# EAGLE schematic ButtonsLEDs (EAGLE 7.4.0)
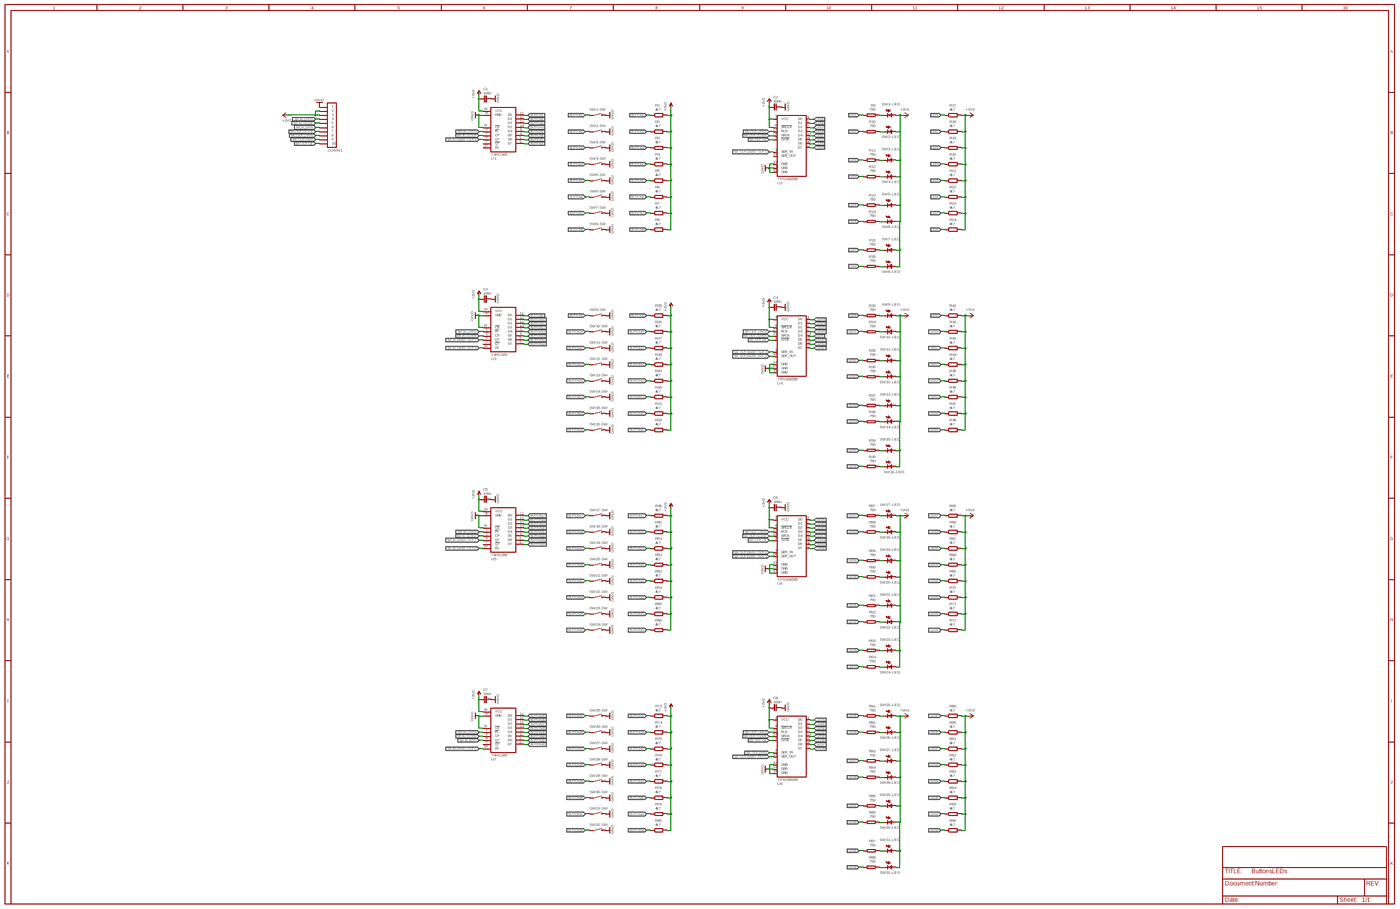
[diagram p0: schematic, sheet 1, overview]
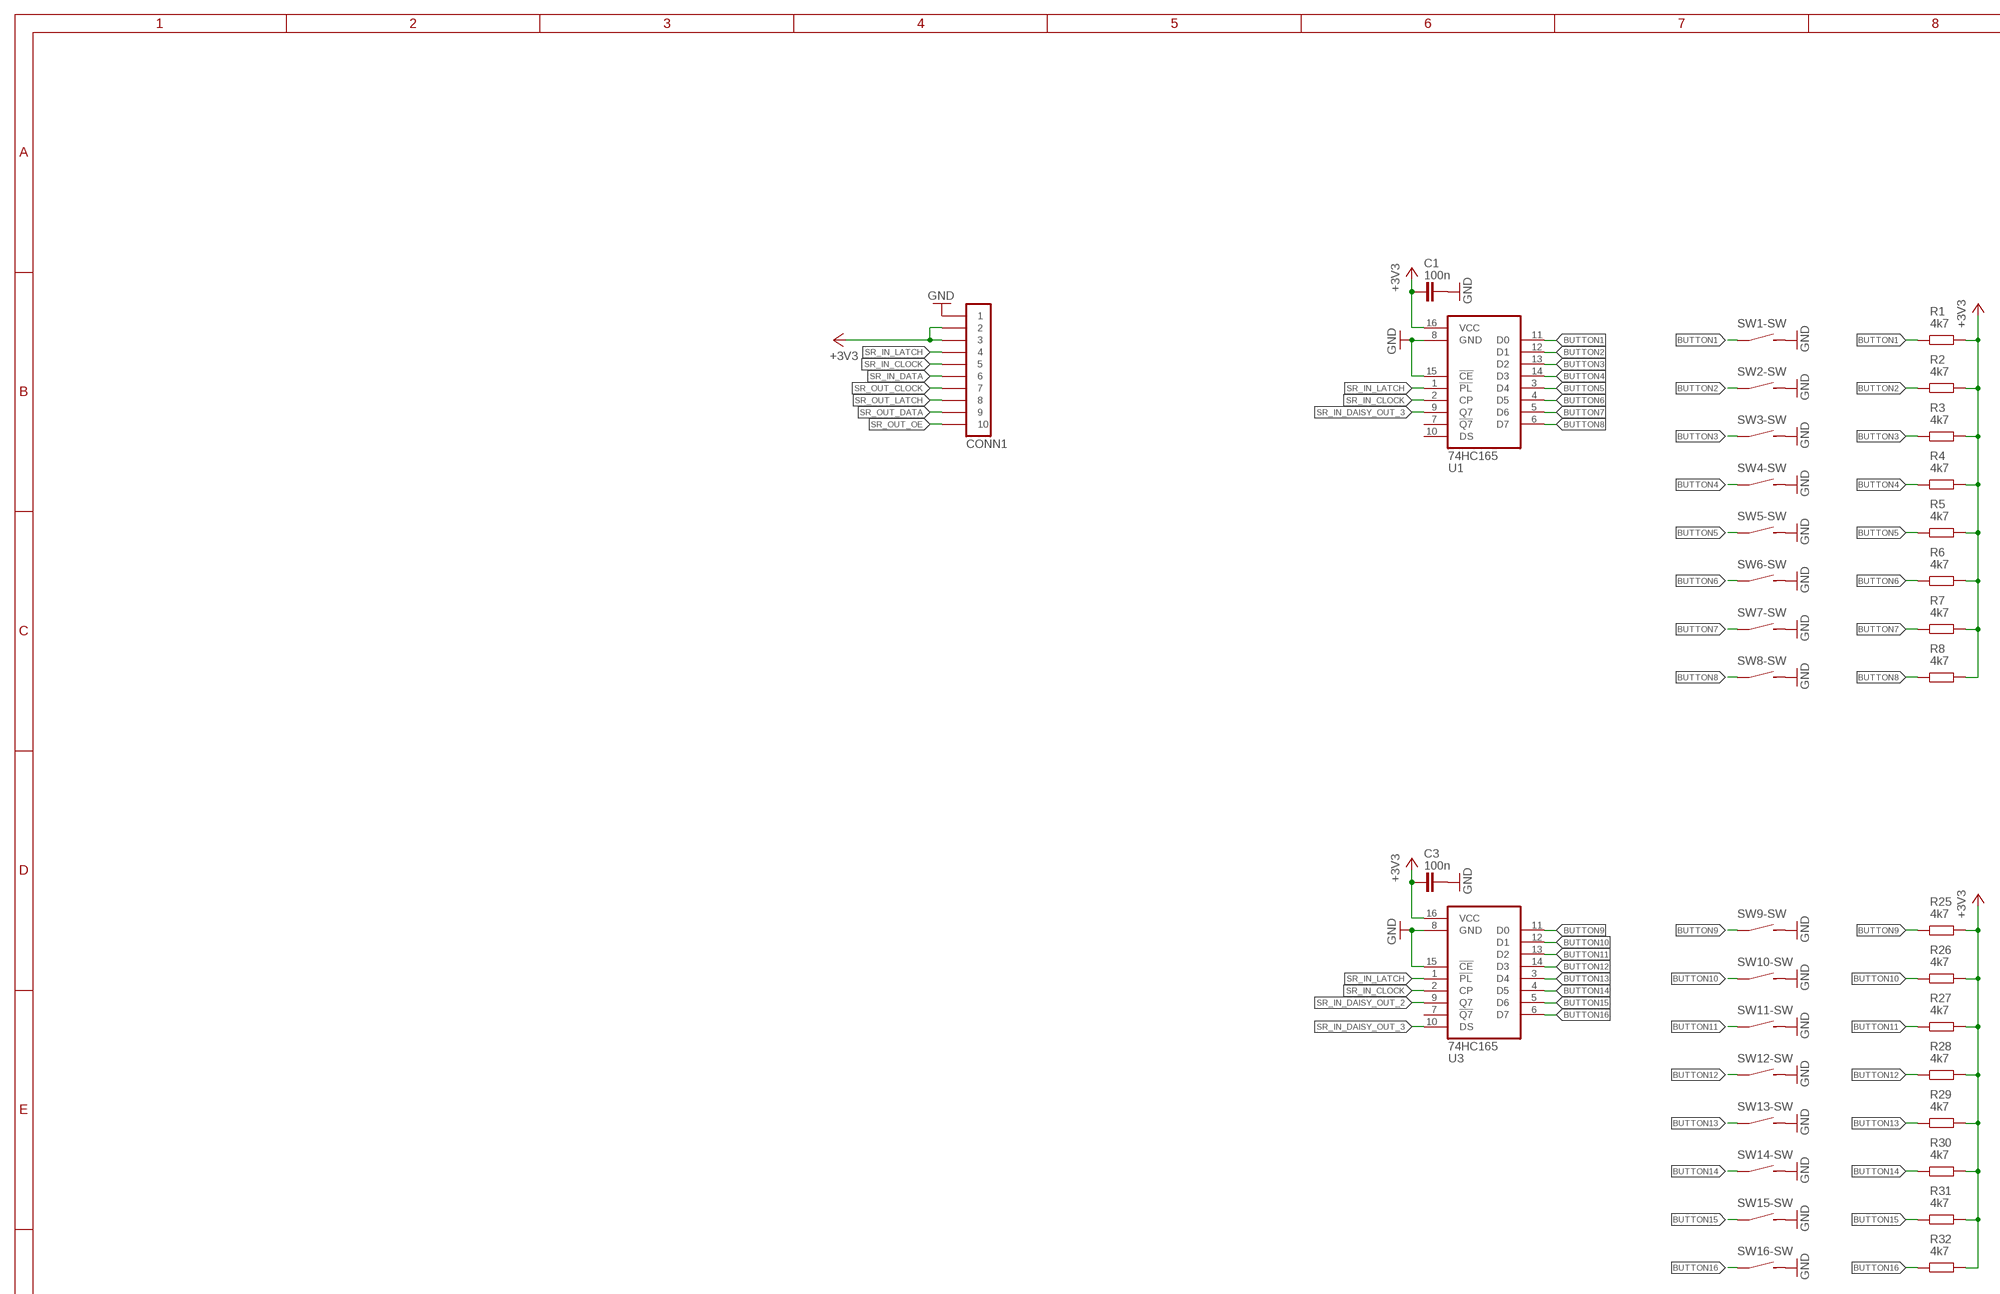
[diagram p1: schematic, sheet 1, part 1 of 4]
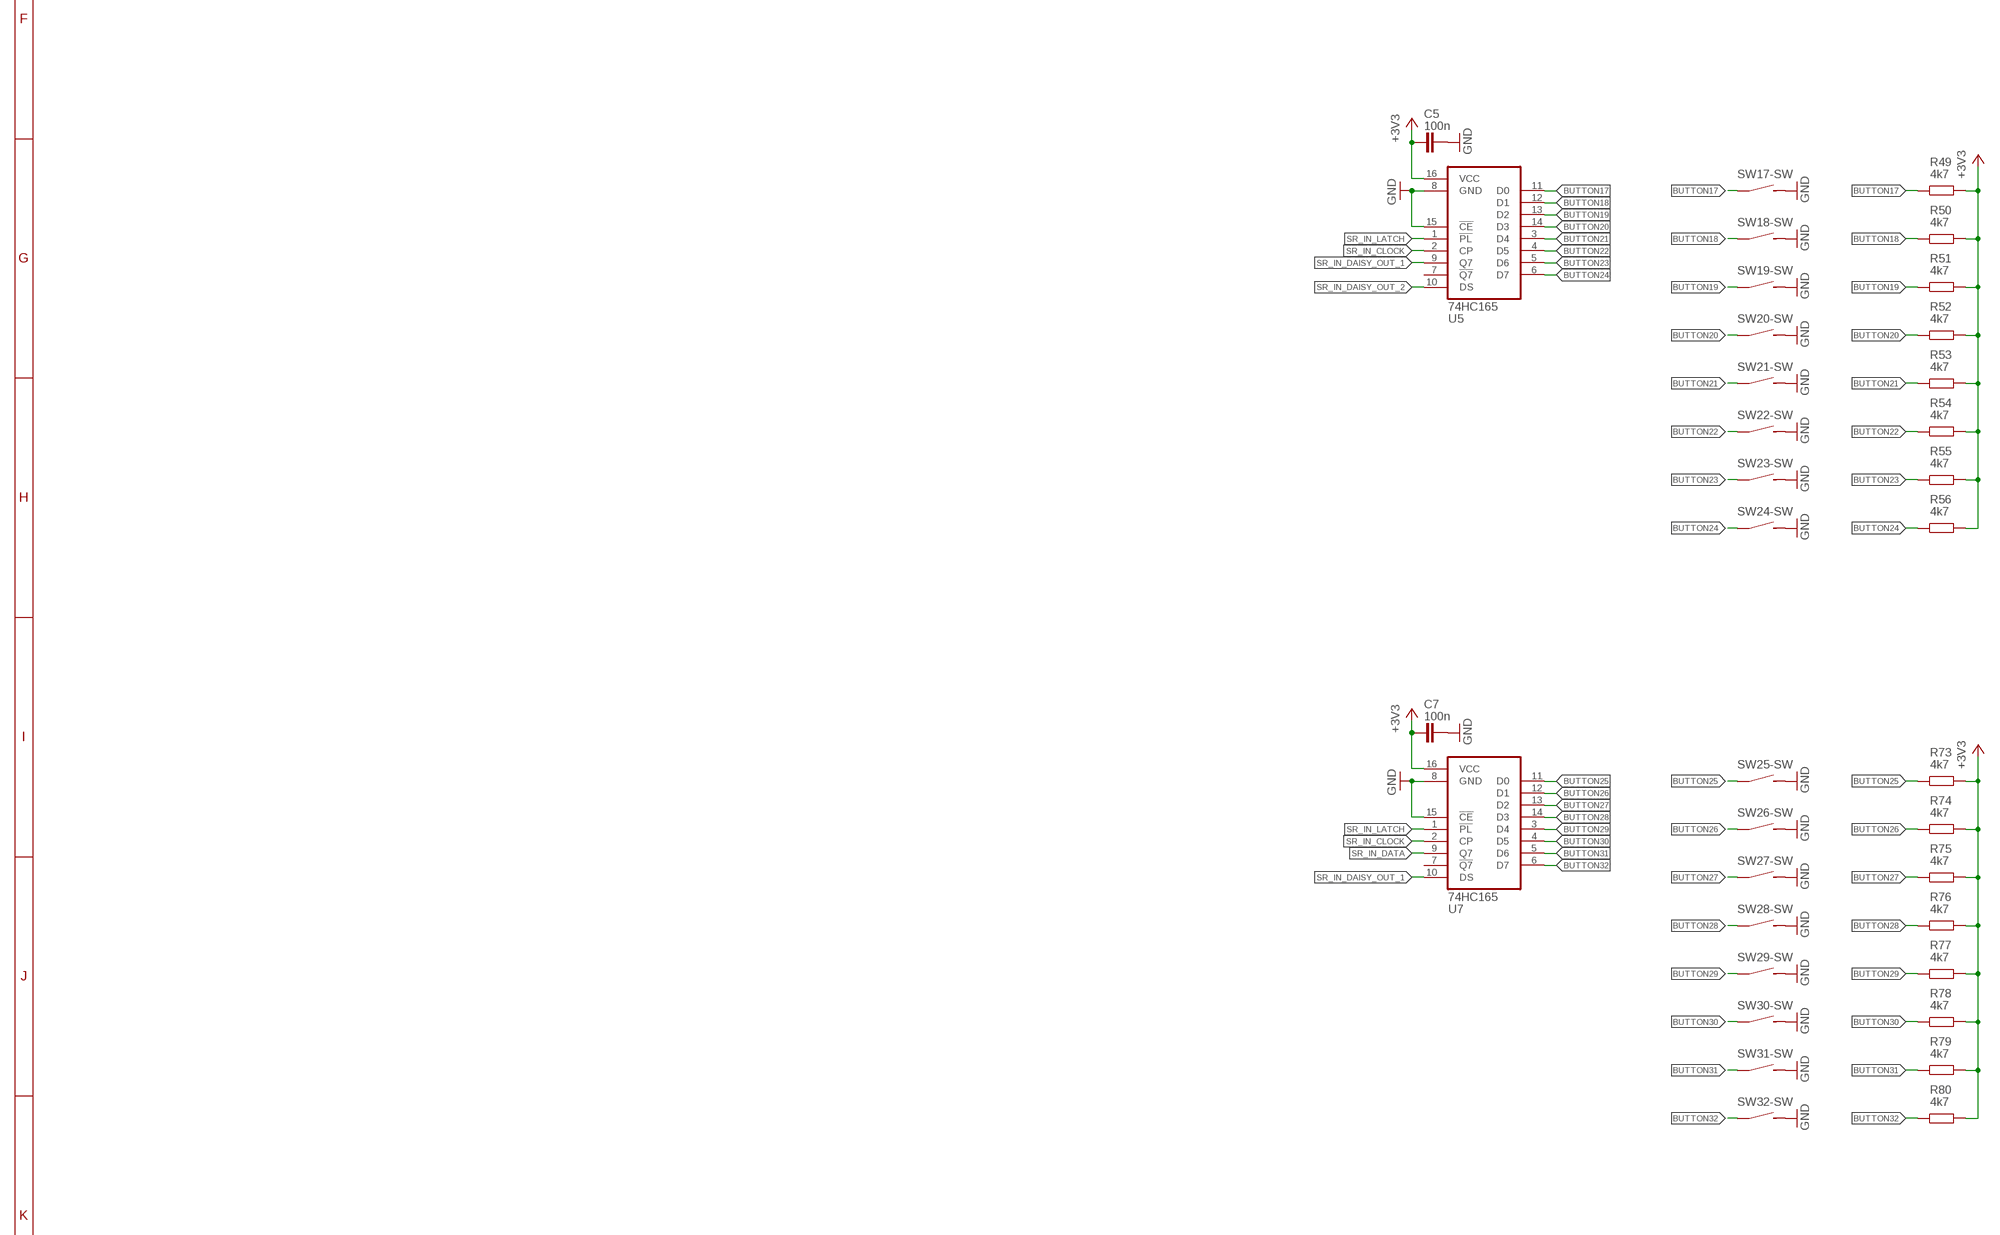
[diagram p2: schematic, sheet 1, part 2 of 4]
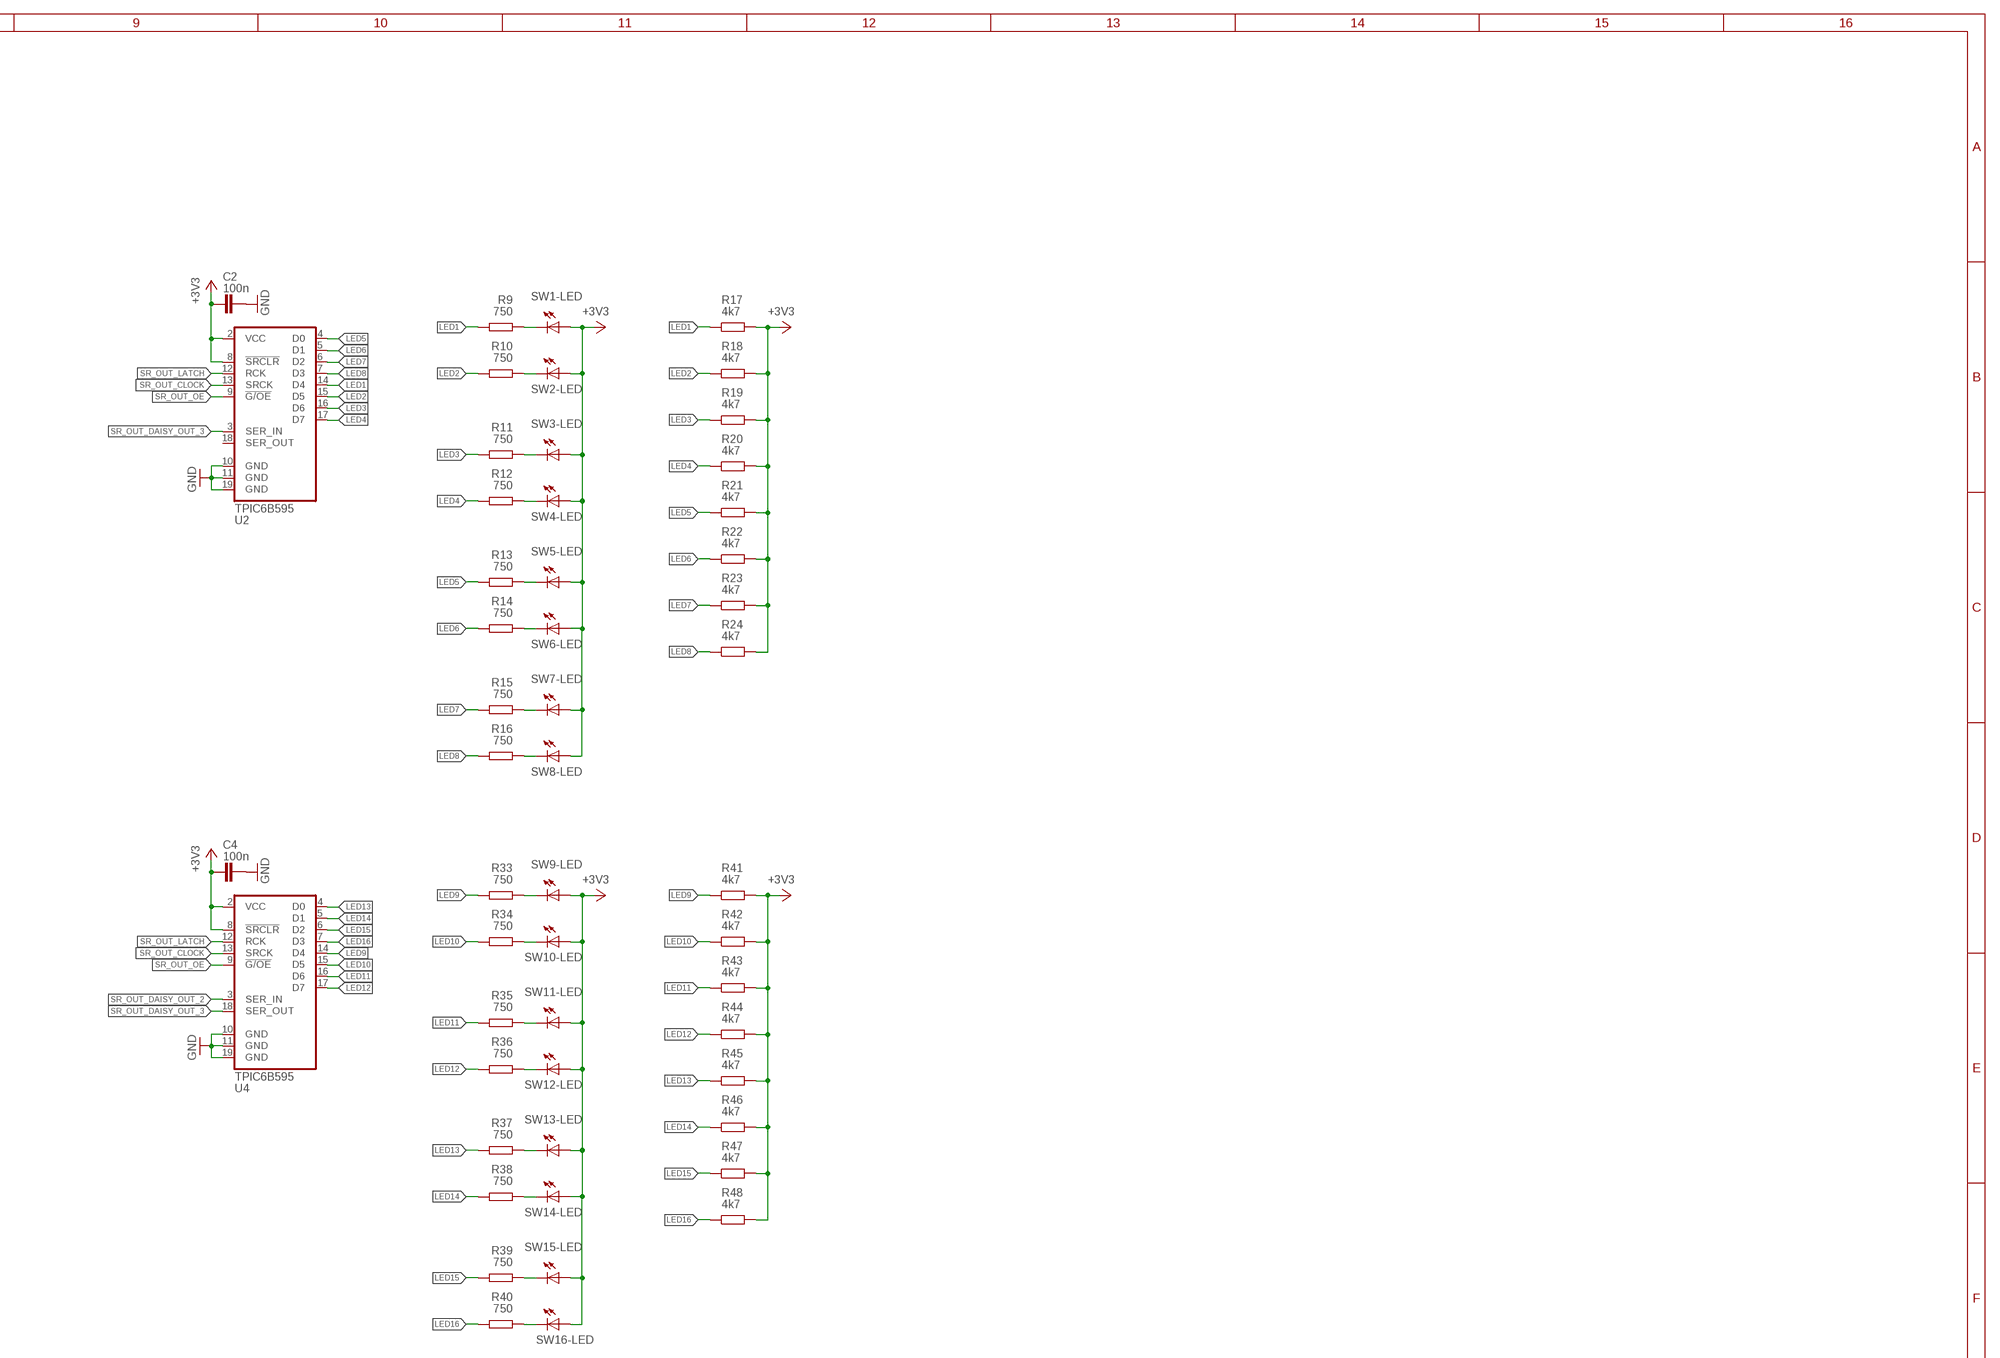
[diagram p3: schematic, sheet 1, part 3 of 4]
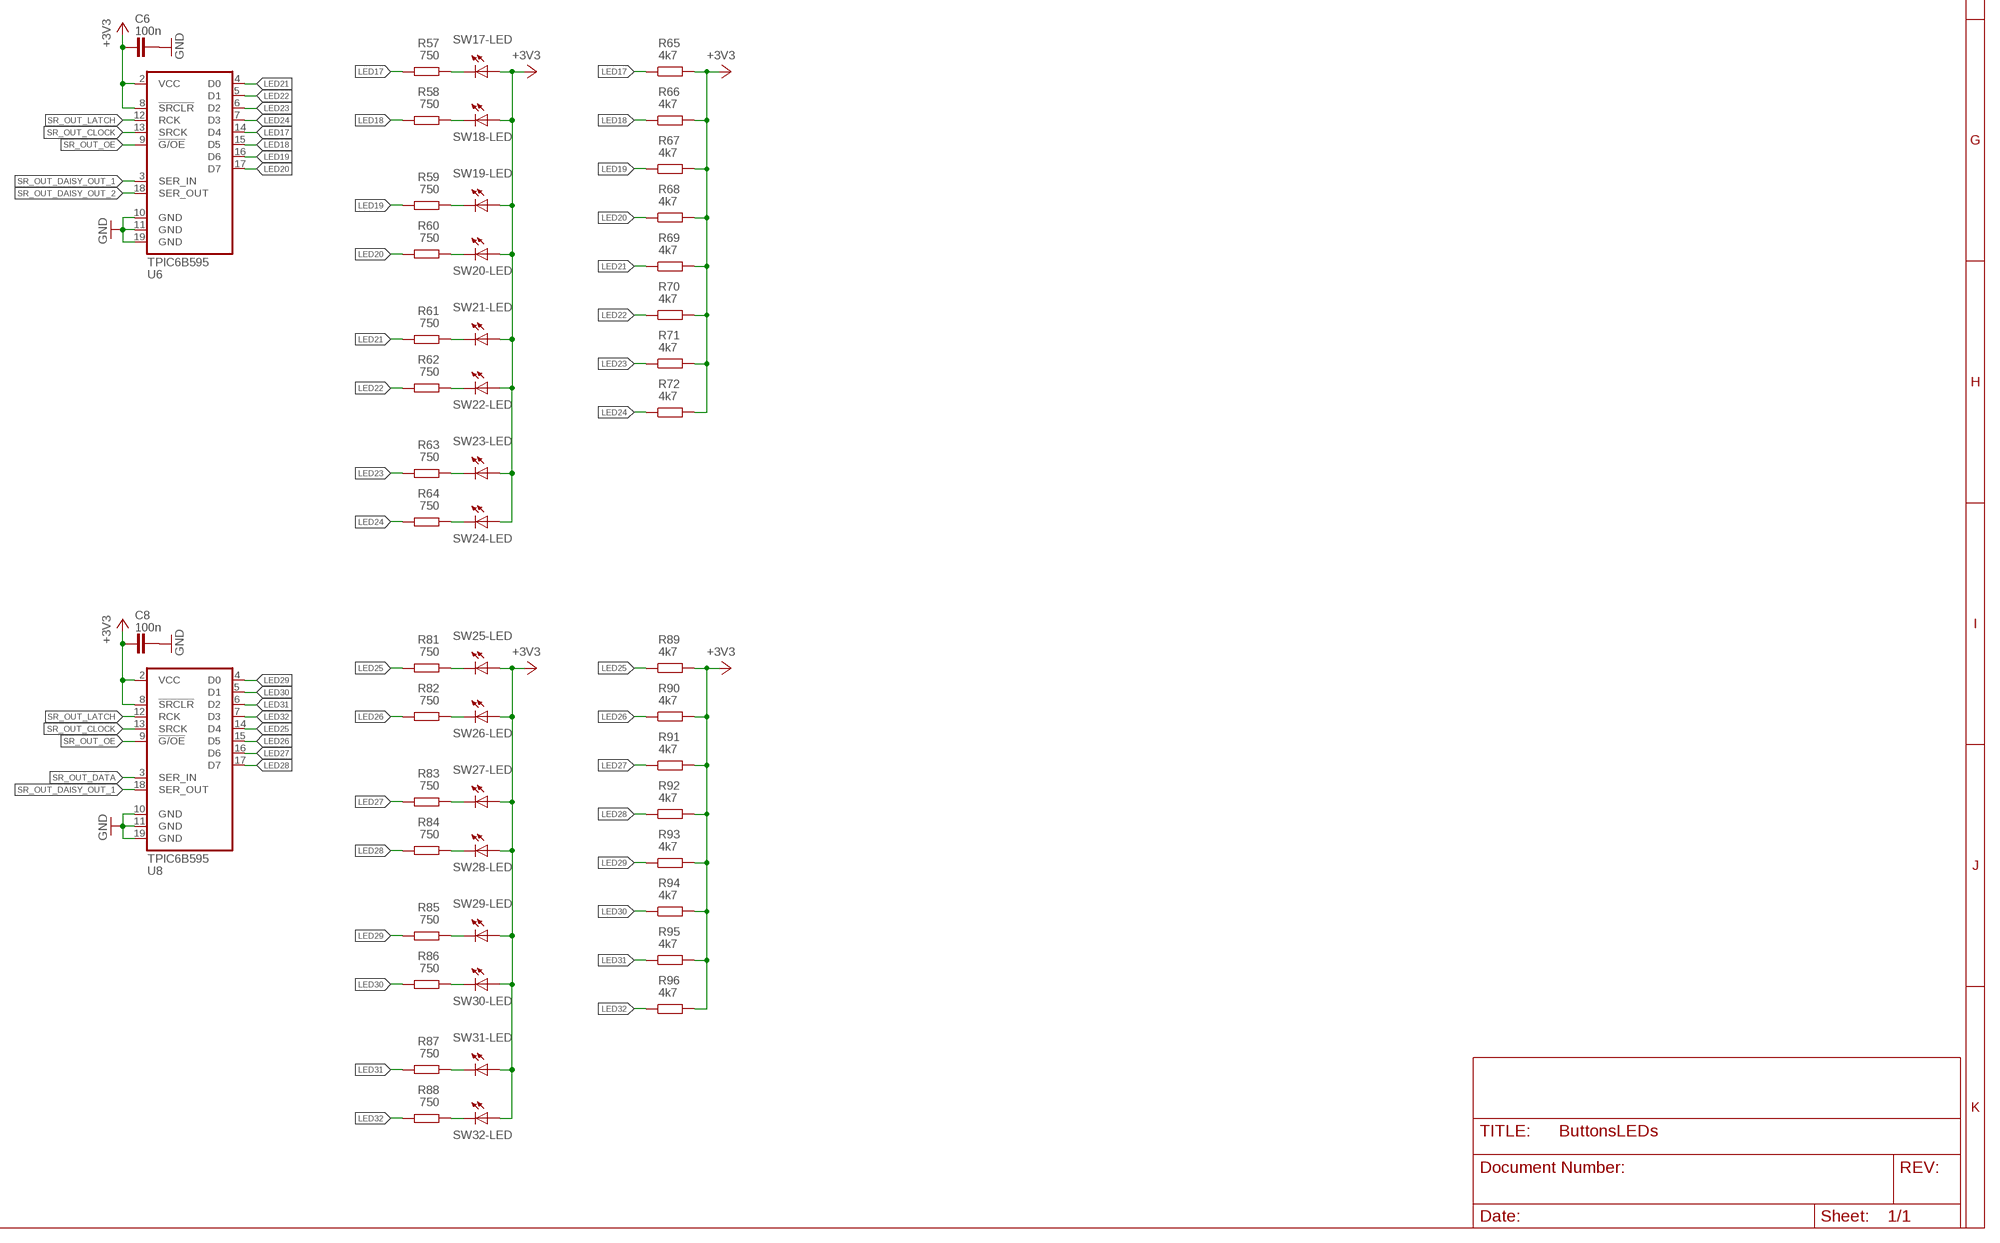
[diagram p4: schematic, sheet 1, part 4 of 4]

## Parts
C1  100n  CAPACITOR-0805  [C0805]
C2  100n  CAPACITOR-0805  [C0805]
C3  100n  CAPACITOR-0805  [C0805]
C4  100n  CAPACITOR-0805  [C0805]
C5  100n  CAPACITOR-0805  [C0805]
C6  100n  CAPACITOR-0805  [C0805]
C7  100n  CAPACITOR-0805  [C0805]
C8  100n  CAPACITOR-0805  [C0805]
CONN1  PINHD-1X10-FFC-1MM-Z  [MOLEX-52271-1079]
R1  4k7  RESISTOR-0805  [R0805]
R2  4k7  RESISTOR-0805  [R0805]
R3  4k7  RESISTOR-0805  [R0805]
R4  4k7  RESISTOR-0805  [R0805]
R5  4k7  RESISTOR-0805  [R0805]
R6  4k7  RESISTOR-0805  [R0805]
R7  4k7  RESISTOR-0805  [R0805]
R8  4k7  RESISTOR-0805  [R0805]
R9  750  RESISTOR-0805  [R0805]
R10  750  RESISTOR-0805  [R0805]
R11  750  RESISTOR-0805  [R0805]
R12  750  RESISTOR-0805  [R0805]
R13  750  RESISTOR-0805  [R0805]
R14  750  RESISTOR-0805  [R0805]
R15  750  RESISTOR-0805  [R0805]
R16  750  RESISTOR-0805  [R0805]
R17  4k7  RESISTOR-0805  [R0805]
R18  4k7  RESISTOR-0805  [R0805]
R19  4k7  RESISTOR-0805  [R0805]
R20  4k7  RESISTOR-0805  [R0805]
R21  4k7  RESISTOR-0805  [R0805]
R22  4k7  RESISTOR-0805  [R0805]
R23  4k7  RESISTOR-0805  [R0805]
R24  4k7  RESISTOR-0805  [R0805]
R25  4k7  RESISTOR-0805  [R0805]
R26  4k7  RESISTOR-0805  [R0805]
R27  4k7  RESISTOR-0805  [R0805]
R28  4k7  RESISTOR-0805  [R0805]
R29  4k7  RESISTOR-0805  [R0805]
R30  4k7  RESISTOR-0805  [R0805]
R31  4k7  RESISTOR-0805  [R0805]
R32  4k7  RESISTOR-0805  [R0805]
R33  750  RESISTOR-0805  [R0805]
R34  750  RESISTOR-0805  [R0805]
R35  750  RESISTOR-0805  [R0805]
R36  750  RESISTOR-0805  [R0805]
R37  750  RESISTOR-0805  [R0805]
R38  750  RESISTOR-0805  [R0805]
R39  750  RESISTOR-0805  [R0805]
R40  750  RESISTOR-0805  [R0805]
R41  4k7  RESISTOR-0805  [R0805]
R42  4k7  RESISTOR-0805  [R0805]
R43  4k7  RESISTOR-0805  [R0805]
R44  4k7  RESISTOR-0805  [R0805]
R45  4k7  RESISTOR-0805  [R0805]
R46  4k7  RESISTOR-0805  [R0805]
R47  4k7  RESISTOR-0805  [R0805]
R48  4k7  RESISTOR-0805  [R0805]
R49  4k7  RESISTOR-0805  [R0805]
R50  4k7  RESISTOR-0805  [R0805]
R51  4k7  RESISTOR-0805  [R0805]
R52  4k7  RESISTOR-0805  [R0805]
R53  4k7  RESISTOR-0805  [R0805]
R54  4k7  RESISTOR-0805  [R0805]
R55  4k7  RESISTOR-0805  [R0805]
R56  4k7  RESISTOR-0805  [R0805]
R57  750  RESISTOR-0805  [R0805]
R58  750  RESISTOR-0805  [R0805]
R59  750  RESISTOR-0805  [R0805]
R60  750  RESISTOR-0805  [R0805]
R61  750  RESISTOR-0805  [R0805]
R62  750  RESISTOR-0805  [R0805]
R63  750  RESISTOR-0805  [R0805]
R64  750  RESISTOR-0805  [R0805]
R65  4k7  RESISTOR-0805  [R0805]
R66  4k7  RESISTOR-0805  [R0805]
R67  4k7  RESISTOR-0805  [R0805]
R68  4k7  RESISTOR-0805  [R0805]
R69  4k7  RESISTOR-0805  [R0805]
R70  4k7  RESISTOR-0805  [R0805]
R71  4k7  RESISTOR-0805  [R0805]
R72  4k7  RESISTOR-0805  [R0805]
R73  4k7  RESISTOR-0805  [R0805]
R74  4k7  RESISTOR-0805  [R0805]
R75  4k7  RESISTOR-0805  [R0805]
R76  4k7  RESISTOR-0805  [R0805]
R77  4k7  RESISTOR-0805  [R0805]
R78  4k7  RESISTOR-0805  [R0805]
R79  4k7  RESISTOR-0805  [R0805]
R80  4k7  RESISTOR-0805  [R0805]
R81  750  RESISTOR-0805  [R0805]
R82  750  RESISTOR-0805  [R0805]
R83  750  RESISTOR-0805  [R0805]
R84  750  RESISTOR-0805  [R0805]
R85  750  RESISTOR-0805  [R0805]
R86  750  RESISTOR-0805  [R0805]
R87  750  RESISTOR-0805  [R0805]
R88  750  RESISTOR-0805  [R0805]
R89  4k7  RESISTOR-0805  [R0805]
R90  4k7  RESISTOR-0805  [R0805]
R91  4k7  RESISTOR-0805  [R0805]
R92  4k7  RESISTOR-0805  [R0805]
R93  4k7  RESISTOR-0805  [R0805]
R94  4k7  RESISTOR-0805  [R0805]
R95  4k7  RESISTOR-0805  [R0805]
R96  4k7  RESISTOR-0805  [R0805]
SW1  OMRON-B3W-9  [OMRON-B3W-9]
SW2  OMRON-B3W-9  [OMRON-B3W-9]
SW3  OMRON-B3W-9  [OMRON-B3W-9]
SW4  OMRON-B3W-9  [OMRON-B3W-9]
SW5  OMRON-B3W-9  [OMRON-B3W-9]
SW6  OMRON-B3W-9  [OMRON-B3W-9]
SW7  OMRON-B3W-9  [OMRON-B3W-9]
SW8  OMRON-B3W-9  [OMRON-B3W-9]
SW9  OMRON-B3W-9  [OMRON-B3W-9]
SW10  OMRON-B3W-9  [OMRON-B3W-9]
SW11  OMRON-B3W-9  [OMRON-B3W-9]
SW12  OMRON-B3W-9  [OMRON-B3W-9]
SW13  OMRON-B3W-9  [OMRON-B3W-9]
SW14  OMRON-B3W-9  [OMRON-B3W-9]
SW15  OMRON-B3W-9  [OMRON-B3W-9]
SW16  OMRON-B3W-9  [OMRON-B3W-9]
SW17  OMRON-B3W-9  [OMRON-B3W-9]
SW18  OMRON-B3W-9  [OMRON-B3W-9]
SW19  OMRON-B3W-9  [OMRON-B3W-9]
SW20  OMRON-B3W-9  [OMRON-B3W-9]
SW21  OMRON-B3W-9  [OMRON-B3W-9]
SW22  OMRON-B3W-9  [OMRON-B3W-9]
SW23  OMRON-B3W-9  [OMRON-B3W-9]
SW24  OMRON-B3W-9  [OMRON-B3W-9]
SW25  OMRON-B3W-9  [OMRON-B3W-9]
SW26  OMRON-B3W-9  [OMRON-B3W-9]
SW27  OMRON-B3W-9  [OMRON-B3W-9]
SW28  OMRON-B3W-9  [OMRON-B3W-9]
SW29  OMRON-B3W-9  [OMRON-B3W-9]
SW30  OMRON-B3W-9  [OMRON-B3W-9]
SW31  OMRON-B3W-9  [OMRON-B3W-9]
SW32  OMRON-B3W-9  [OMRON-B3W-9]
U1  74HC165  [SO16]
U2  TPIC6B595  [SOIC20]
U3  74HC165  [SO16]
U4  TPIC6B595  [SOIC20]
U5  74HC165  [SO16]
U6  TPIC6B595  [SOIC20]
U7  74HC165  [SO16]
U8  TPIC6B595  [SOIC20]

## Nets
+3V3: C1.1 C2.1 C3.1 C4.1 C5.1 C6.1 C7.1 C8.1 CONN1.2 CONN1.3 R1.2 R2.2 R3.2 R4.2 R5.2 R6.2 R7.2 R8.2 R17.2 R18.2 R19.2 R20.2 R21.2 R22.2 R23.2 R24.2 R25.2 R26.2 R27.2 R28.2 R29.2 R30.2 R31.2 R32.2 R41.2 R42.2 R43.2 R44.2 R45.2 R46.2 R47.2 R48.2 R49.2 R50.2 R51.2 R52.2 R53.2 R54.2 R55.2 R56.2 R65.2 R66.2 R67.2 R68.2 R69.2 R70.2 R71.2 R72.2 R73.2 R74.2 R75.2 R76.2 R77.2 R78.2 R79.2 R80.2 R89.2 R90.2 R91.2 R92.2 R93.2 R94.2 R95.2 R96.2 SW1.6-A(-LED:A) SW2.6-A(-LED:A) SW3.6-A(-LED:A) SW4.6-A(-LED:A) SW5.6-A(-LED:A) SW6.6-A(-LED:A) SW7.6-A(-LED:A) SW8.6-A(-LED:A) SW9.6-A(-LED:A) SW10.6-A(-LED:A) SW11.6-A(-LED:A) SW12.6-A(-LED:A) SW13.6-A(-LED:A) SW14.6-A(-LED:A) SW15.6-A(-LED:A) SW16.6-A(-LED:A) SW17.6-A(-LED:A) SW18.6-A(-LED:A) SW19.6-A(-LED:A) SW20.6-A(-LED:A) SW21.6-A(-LED:A) SW22.6-A(-LED:A) SW23.6-A(-LED:A) SW24.6-A(-LED:A) SW25.6-A(-LED:A) SW26.6-A(-LED:A) SW27.6-A(-LED:A) SW28.6-A(-LED:A) SW29.6-A(-LED:A) SW30.6-A(-LED:A) SW31.6-A(-LED:A) SW32.6-A(-LED:A) U1.16(VCC) U2.2(VCC) U2.8(!SRCLR) U3.16(VCC) U4.2(VCC) U4.8(!SRCLR) U5.16(VCC) U6.2(VCC) U6.8(!SRCLR) U7.16(VCC) U8.2(VCC) U8.8(!SRCLR)
BUTTON1: R1.1 SW1.1 U1.11(D0)
BUTTON2: R2.1 SW2.1 U1.12(D1)
BUTTON3: R3.1 SW3.1 U1.13(D2)
BUTTON4: R4.1 SW4.1 U1.14(D3)
BUTTON5: R5.1 SW5.1 U1.3(D4)
BUTTON6: R6.1 SW6.1 U1.4(D5)
BUTTON7: R7.1 SW7.1 U1.5(D6)
BUTTON8: R8.1 SW8.1 U1.6(D7)
BUTTON9: R25.1 SW9.1 U3.11(D0)
BUTTON10: R26.1 SW10.1 U3.12(D1)
BUTTON11: R27.1 SW11.1 U3.13(D2)
BUTTON12: R28.1 SW12.1 U3.14(D3)
BUTTON13: R29.1 SW13.1 U3.3(D4)
BUTTON14: R30.1 SW14.1 U3.4(D5)
BUTTON15: R31.1 SW15.1 U3.5(D6)
BUTTON16: R32.1 SW16.1 U3.6(D7)
BUTTON17: R49.1 SW17.1 U5.11(D0)
BUTTON18: R50.1 SW18.1 U5.12(D1)
BUTTON19: R51.1 SW19.1 U5.13(D2)
BUTTON20: R52.1 SW20.1 U5.14(D3)
BUTTON21: R53.1 SW21.1 U5.3(D4)
BUTTON22: R54.1 SW22.1 U5.4(D5)
BUTTON23: R55.1 SW23.1 U5.5(D6)
BUTTON24: R56.1 SW24.1 U5.6(D7)
BUTTON25: R73.1 SW25.1 U7.11(D0)
BUTTON26: R74.1 SW26.1 U7.12(D1)
BUTTON27: R75.1 SW27.1 U7.13(D2)
BUTTON28: R76.1 SW28.1 U7.14(D3)
BUTTON29: R77.1 SW29.1 U7.3(D4)
BUTTON30: R78.1 SW30.1 U7.4(D5)
BUTTON31: R79.1 SW31.1 U7.5(D6)
BUTTON32: R80.1 SW32.1 U7.6(D7)
GND: C1.2 C2.2 C3.2 C4.2 C5.2 C6.2 C7.2 C8.2 CONN1.1 SW1.3 SW2.3 SW3.3 SW4.3 SW5.3 SW6.3 SW7.3 SW8.3 SW9.3 SW10.3 SW11.3 SW12.3 SW13.3 SW14.3 SW15.3 SW16.3 SW17.3 SW18.3 SW19.3 SW20.3 SW21.3 SW22.3 SW23.3 SW24.3 SW25.3 SW26.3 SW27.3 SW28.3 SW29.3 SW30.3 SW31.3 SW32.3 U1.8(GND) U1.15(!CE) U2.10(GND) U2.11(GND) U2.19(GND) U3.8(GND) U3.15(!CE) U4.10(GND) U4.11(GND) U4.19(GND) U5.8(GND) U5.15(!CE) U6.10(GND) U6.11(GND) U6.19(GND) U7.8(GND) U7.15(!CE) U8.10(GND) U8.11(GND) U8.19(GND)
LED1: R9.2 R17.1 U2.14(D4)
LED1_R: R9.1 SW1.6-C(-LED:C)
LED2: R10.2 R18.1 U2.15(D5)
LED2_R: R10.1 SW2.6-C(-LED:C)
LED3: R11.2 R19.1 U2.16(D6)
LED3_R: R11.1 SW3.6-C(-LED:C)
LED4: R12.2 R20.1 U2.17(D7)
LED4_R: R12.1 SW4.6-C(-LED:C)
LED5: R13.2 R21.1 U2.4(D0)
LED5_R: R13.1 SW5.6-C(-LED:C)
LED6: R14.2 R22.1 U2.5(D1)
LED6_R: R14.1 SW6.6-C(-LED:C)
LED7: R15.2 R23.1 U2.6(D2)
LED7_R: R15.1 SW7.6-C(-LED:C)
LED8: R16.2 R24.1 U2.7(D3)
LED8_R: R16.1 SW8.6-C(-LED:C)
LED9: R33.2 R41.1 U4.14(D4)
LED9_R: R33.1 SW9.6-C(-LED:C)
LED10: R34.2 R42.1 U4.15(D5)
LED10_R: R34.1 SW10.6-C(-LED:C)
LED11: R35.2 R43.1 U4.16(D6)
LED11_R: R35.1 SW11.6-C(-LED:C)
LED12: R36.2 R44.1 U4.17(D7)
LED12_R: R36.1 SW12.6-C(-LED:C)
LED13: R37.2 R45.1 U4.4(D0)
LED13_R: R37.1 SW13.6-C(-LED:C)
LED14: R38.2 R46.1 U4.5(D1)
LED14_R: R38.1 SW14.6-C(-LED:C)
LED15: R39.2 R47.1 U4.6(D2)
LED15_R: R39.1 SW15.6-C(-LED:C)
LED16: R40.2 R48.1 U4.7(D3)
LED16_R: R40.1 SW16.6-C(-LED:C)
LED17: R57.2 R65.1 U6.14(D4)
LED17_R: R57.1 SW17.6-C(-LED:C)
LED18: R58.2 R66.1 U6.15(D5)
LED18_R: R58.1 SW18.6-C(-LED:C)
LED19: R59.2 R67.1 U6.16(D6)
LED19_R: R59.1 SW19.6-C(-LED:C)
LED20: R60.2 R68.1 U6.17(D7)
LED20_R: R60.1 SW20.6-C(-LED:C)
LED21: R61.2 R69.1 U6.4(D0)
LED21_R: R61.1 SW21.6-C(-LED:C)
LED22: R62.2 R70.1 U6.5(D1)
LED22_R: R62.1 SW22.6-C(-LED:C)
LED23: R63.2 R71.1 U6.6(D2)
LED23_R: R63.1 SW23.6-C(-LED:C)
LED24: R64.2 R72.1 U6.7(D3)
LED24_R: R64.1 SW24.6-C(-LED:C)
LED25: R81.2 R89.1 U8.14(D4)
LED25_R: R81.1 SW25.6-C(-LED:C)
LED26: R82.2 R90.1 U8.15(D5)
LED26_R: R82.1 SW26.6-C(-LED:C)
LED27: R83.2 R91.1 U8.16(D6)
LED27_R: R83.1 SW27.6-C(-LED:C)
LED28: R84.2 R92.1 U8.17(D7)
LED28_R: R84.1 SW28.6-C(-LED:C)
LED29: R85.2 R93.1 U8.4(D0)
LED29_R: R85.1 SW29.6-C(-LED:C)
LED30: R86.2 R94.1 U8.5(D1)
LED30_R: R86.1 SW30.6-C(-LED:C)
LED31: R87.2 R95.1 U8.6(D2)
LED31_R: R87.1 SW31.6-C(-LED:C)
LED32: R88.2 R96.1 U8.7(D3)
LED32_R: R88.1 SW32.6-C(-LED:C)
SR_IN_CLOCK: CONN1.5 U1.2(CP) U3.2(CP) U5.2(CP) U7.2(CP)
SR_IN_DAISY_OUT_1: U5.9(Q7) U7.10(DS)
SR_IN_DAISY_OUT_2: U3.9(Q7) U5.10(DS)
SR_IN_DAISY_OUT_3: U1.9(Q7) U3.10(DS)
SR_IN_DATA: CONN1.6 U7.9(Q7)
SR_IN_LATCH: CONN1.4 U1.1(!PL) U3.1(!PL) U5.1(!PL) U7.1(!PL)
SR_OUT_CLOCK: CONN1.7 U2.13(SRCK) U4.13(SRCK) U6.13(SRCK) U8.13(SRCK)
SR_OUT_DAISY_OUT_1: U6.3(SER_IN) U8.18(SER_OUT)
SR_OUT_DAISY_OUT_2: U4.3(SER_IN) U6.18(SER_OUT)
SR_OUT_DAISY_OUT_3: U2.3(SER_IN) U4.18(SER_OUT)
SR_OUT_DATA: CONN1.9 U8.3(SER_IN)
SR_OUT_LATCH: CONN1.8 U2.12(RCK) U4.12(RCK) U6.12(RCK) U8.12(RCK)
SR_OUT_OE: CONN1.10 U2.9(!G/OE) U4.9(!G/OE) U6.9(!G/OE) U8.9(!G/OE)
Unconnected: U1.7(!Q7) U1.10(DS) U2.18(SER_OUT) U3.7(!Q7) U5.7(!Q7) U7.7(!Q7)

## Library data of the parts
C1-C8 = igor_lbr:CAPACITOR: Capacitor
CONN1 = igor_lbr:PINHD-1X10: Pin header; MANUFACTURER: Molex; MPN: 52271-1079
R1-R96 = igor_lbr:RESISTOR: Resistor
SW1-SW32 = igor_lbr:OMRON-B3W-9: Illuminated Tactile Switch
U1 U3 U5 U7 = igor_lbr:74*165: 8-bit parallel-in/serial out shift register; MANUFACTURER: Nexperia; MPN: 74HC165D
U2 U4 U6 U8 = igor_lbr:TPIC6B595: Power Logic 8-Bit Shift Register